# EAGLE board iot-gateway-main (EAGLE 9.6.1), part 1 of 2
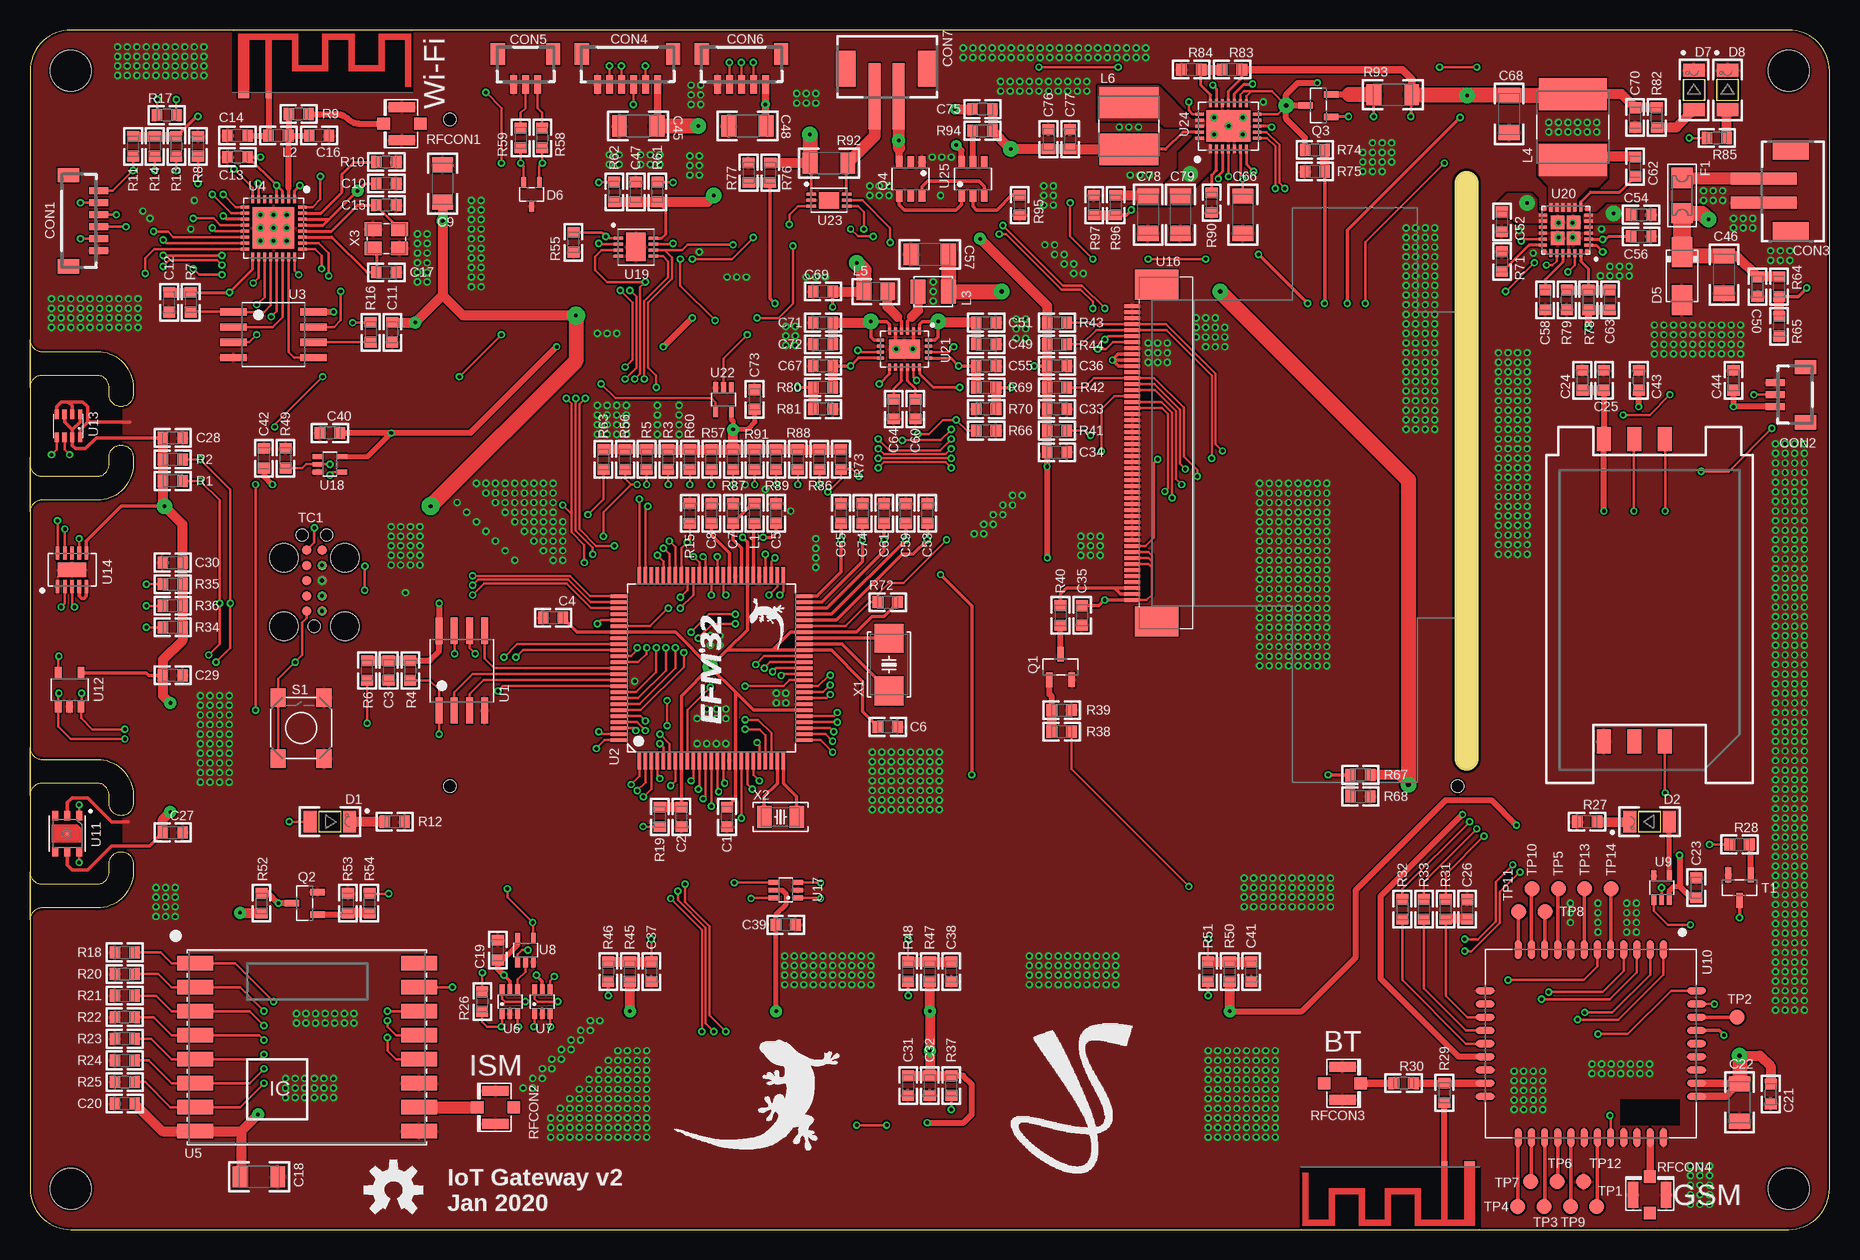
[diagram p11: board, top side]
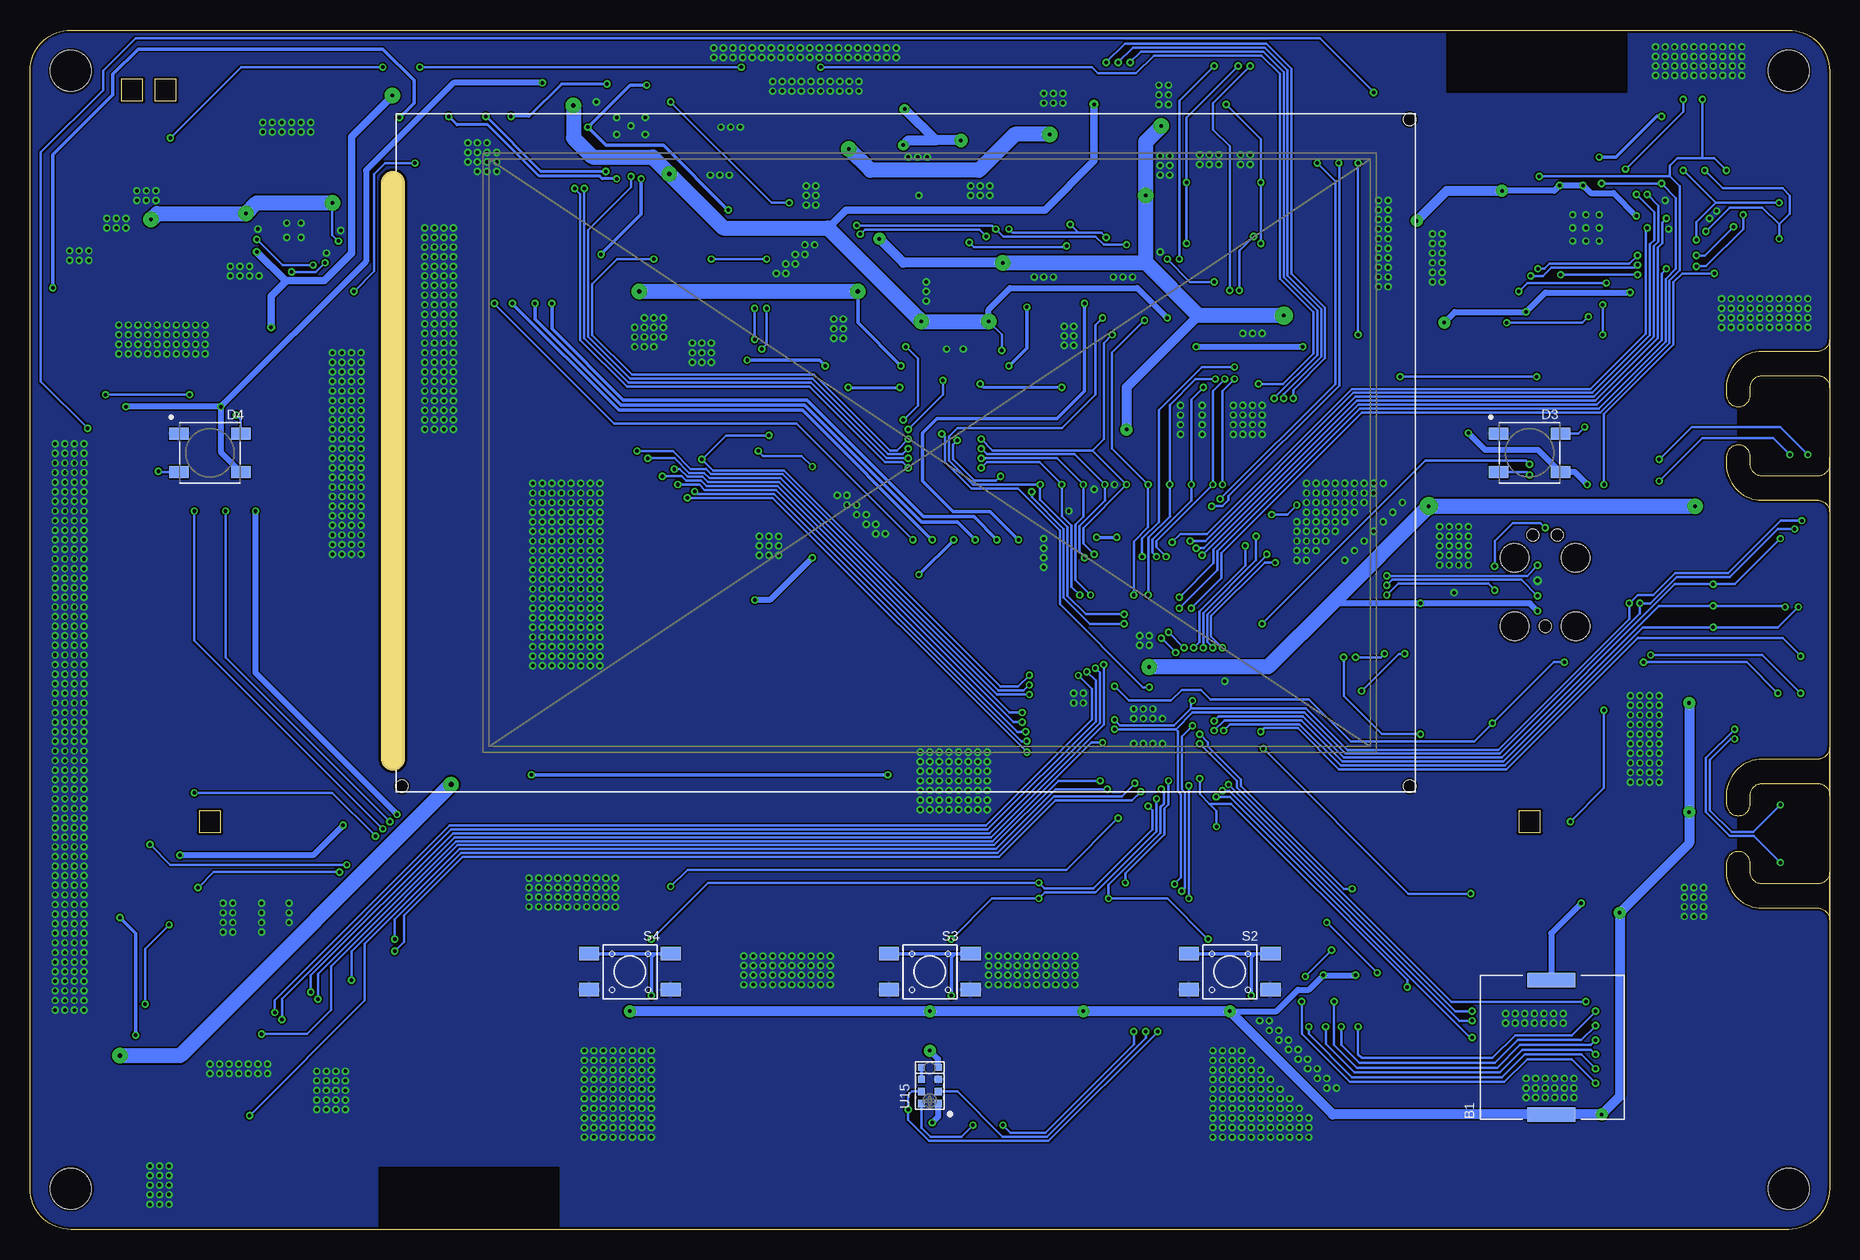
[diagram p12: board, bottom side, seen from below]

Size 150 x 100 mm. Coordinates in mm from the lower left corner, seen from the top.
Outline: 150,3.4 150,96.6 arc90 146.6,100 3.4,100 arc90 0,96.6 0,3.4 arc90 3.4,0 146.6,0 arc90 150,3.4
Copper layers (1*16): Top 0.035mm / dielectric 1.6mm / Bottom 0.035mm
Design rules "jlcpcb_2layer": minimum track width 5mil, minimum drill 0.3mm, track to track 5mil, track to pad 5mil, pad to pad 5mil, via to via 5mil, smd to smd 5mil, copper to edge 0.2mm, drill to drill 5mil, minimum pad ring 3mil, minimum via ring 3mil, stop-mask expansion 0.075mm, vias tented up to drill 10mm, thermal gap 5mil
Holes 3.4 mm at 146.6,96.6 146.6,3.4 3.4,3.4 3.4,96.6
tKeepout: area 0.9,94.1 to 5.9,99.1; area -1.6,-1.6 to 8.4,8.4; area 141.6,-1.6 to 151.6,8.4; area 0,3.4 to 3.4,8.4; area 3.4,0 to 8.4,3.4; area 146.6,3.4 to 150,8.4; area 141.6,0 to 146.6,3.4; area 144.1,94.1 to 149.1,99.1
bKeepout: area 144.1,94.1 to 149.1,99.1; area 0.9,94.1 to 5.9,99.1; area 0.9,0.9 to 5.9,5.9; area 144.1,0.9 to 149.1,5.9
Milling: area 0,68.6 to 8.6,74.2; area 0,59.8 to 8.6,65.4; area 0,34.5 to 8.6,40.2; area 0,25.8 to 8.6,31.5

## Footprints (pad centres in the part's own frame; a part is rotated, then mirrored left to right if it is on the bottom)
SMD = smd 1.2 x 4: 1 -5.6,0.1; 2 5.6,0.1
CAP0603 = smd 0.889 x 1.016: 1 -0.819,0; 2 0.819,0
CAP1206 = smd 1.27 x 1.778: 1 -1.549,0; 2 1.549,0
SH-06-TOP = smd 0.6 x 1.55: 1 2.5,-1.625; 2 1.5,-1.625; 3 0.5,-1.625; 4 -0.5,-1.625; 5 -1.5,-1.625; 6 -2.5,-1.625 | smd 1.2 x 1.8: FIT@1 3.8,0.9; FIT@2 -3.8,0.9
SH-03-TOP = smd 0.6 x 1.55: 1 1,-1.625; 2 0,-1.625; 3 -1,-1.625 | smd 1.2 x 1.8: FIT@1 2.3,0.9; FIT@2 -2.3,0.9
PH-02-TOP = smd 1 x 5.5: 1 -1,-2; 2 1,-2 | smd 1.6 x 3: P$1 -3.4,0.27; P$2 3.4,0.27
SH-05-TOP = smd 0.6 x 1.55: 1 2,-1.625; 2 1,-1.625; 3 0,-1.625; 4 -1,-1.625; 5 -2,-1.625 | smd 1.2 x 1.8: FIT@1 3.3,0.9; FIT@2 -3.3,0.9
1206_REV = smd 1.07 x 1.778: A 1.649,0; C -1.649,0
WS2812B-SMD5050 = smd 1.651 x 1: 1 2.577,-1.6; 2 2.577,1.6; 3 -2.577,1.6; 4 -2.577,-1.6
DO214AC = smd 2.5 x 1.7: A 2,0; C -2,0
SC70-3 = smd 0.4 x 0.9: 1 -0.65,-1; 2 0.65,-1; 3 0,1
TRACE_ANTENNA_2.4GHZ_15.2MM = smd 0.5 x 0.5: ANT 0,-0.25 | smd 0.9 x 0.5: GND -2.1,-0.25
1206 = smd 1.7 x 1.803: 1 -1.472,0; 2 1.472,0
IND0603 = smd 0.889 x 1.016: 1 -0.819,0; 2 0.819,0
IND3225 = smd 2 x 1.25: 1 0,-1.275; 2 0,1.275
IND0606 = smd 2.7 x 5.7: 1 -2.75,0; 2 2.75,0
IND0805 = smd 1.245 x 1.473: 1 -0.965,0; 2 0.965,0
IND0505 = smd 2.6 x 4.9: 1 -1.95,0; 2 1.95,0
SOT23 = smd 1.219 x 0.533: 1 -1.067,0.94; 2 -1.067,-0.94; 3 1.067,0
SOT23-6 = smd 1 x 0.55: 1 -1.4,0.95; 2 -1.4,0; 3 -1.4,-0.95; 4 1.4,-0.95; 5 1.4,0; 6 1.4,0.95
RES0603 = smd 0.889 x 1.016: 1 -0.819,0; 2 0.819,0
RES1206 = smd 1.27 x 1.778: 1 -1.549,0; 2 1.549,0
U.FL = smd 2.2 x 0.85: P$1 0,1.375; P$2 0,-1.375 | smd 1.05 x 1: P$3 1.525,0; P$4 -1.525,0
TAC_SW_SMD_RESET = smd 1.524 x 1.27: 1 -2.54,1.905; 2 2.54,1.905; 3 -2.54,-1.905; 4 2.54,-1.905
TAC_SW_SMD_4.5X4.5 = smd 1.7 x 1.1: 1 -3.4,1.5; 2 3.4,1.5; 3 -3.4,-1.5; 4 3.4,-1.5
SIMHOLDER-SMD = smd 2 x 1.2: C1 -12.61,-3.81; C2 -12.61,-1.27; C3 -12.61,1.27; C5 12.61,-3.81; C6 12.61,-1.27; C7 12.61,1.27
TC2050-IDC = smd 0.787 x 0.787: 1 -2.54,-0.635; 2 -1.27,-0.635; 3 0,-0.635; 4 1.27,-0.635; 5 2.54,-0.635; 6 2.54,0.635; 7 1.27,0.635; 8 0,0.635; 9 -1.27,0.635; 10 -2.54,0.635 | hole 0.991: -3.81,0; 3.81,1.016; 3.81,-1.016 | hole 2.375: -3.81,2.54; -3.81,-2.54; 1.905,2.54; 1.905,-2.54
PAD1.27MM = smd 1.27 x 1.27: TP 0,0
WSOIC8 = smd 0.6 x 2.2: 1 -1.905,-3.33; 2 -0.635,-3.33; 3 0.635,-3.33; 4 1.905,-3.33; 5 1.905,3.33; 6 0.635,3.33; 7 -0.635,3.33; 8 -1.905,3.33
QFP100 = smd 1.45 x 0.3: 1 -7.7,6; 2 -7.7,5.5; 3 -7.7,5; 4 -7.7,4.5; 5 -7.7,4; 6 -7.7,3.5; 7 -7.7,3; 8 -7.7,2.5; 9 -7.7,2; 10 -7.7,1.5; 11 -7.7,1; 12 -7.7,0.5; 13 -7.7,0; 14 -7.7,-0.5; 15 -7.7,-1; 16 -7.7,-1.5; 17 -7.7,-2; 18 -7.7,-2.5; 19 -7.7,-3; 20 -7.7,-3.5; 21 -7.7,-4; 22 -7.7,-4.5; 23 -7.7,-5; 24 -7.7,-5.5; 25 -7.7,-6; 51 7.7,-6; 52 7.7,-5.5; 53 7.7,-5; 54 7.7,-4.5; 55 7.7,-4; 56 7.7,-3.5; 57 7.7,-3; 58 7.7,-2.5; 59 7.7,-2; 60 7.7,-1.5; 61 7.7,-1; 62 7.7,-0.5; 63 7.7,0; 64 7.7,0.5; 65 7.7,1; 66 7.7,1.5; 67 7.7,2; 68 7.7,2.5; 69 7.7,3; 70 7.7,3.5; 71 7.7,4; 72 7.7,4.5; 73 7.7,5; 74 7.7,5.5; 75 7.7,6 | smd 0.3 x 1.45: 26 -6,-7.7; 27 -5.5,-7.7; 28 -5,-7.7; 29 -4.5,-7.7; 30 -4,-7.7; 31 -3.5,-7.7; 32 -3,-7.7; 33 -2.5,-7.7; 34 -2,-7.7; 35 -1.5,-7.7; 36 -1,-7.7; 37 -0.5,-7.7; 38 0,-7.7; 39 0.5,-7.7; 40 1,-7.7; 41 1.5,-7.7; 42 2,-7.7; 43 2.5,-7.7; 44 3,-7.7; 45 3.5,-7.7; 46 4,-7.7; 47 4.5,-7.7; 48 5,-7.7; 49 5.5,-7.7; 50 6,-7.7; 76 6,7.7; 77 5.5,7.7; 78 5,7.7; 79 4.5,7.7; 80 4,7.7; 81 3.5,7.7; 82 3,7.7; 83 2.5,7.7; 84 2,7.7; 85 1.5,7.7; 86 1,7.7; 87 0.5,7.7; 88 0,7.7; 89 -0.5,7.7; 90 -1,7.7; 91 -1.5,7.7; 92 -2,7.7; 93 -2.5,7.7; 94 -3,7.7; 95 -3.5,7.7; 96 -4,7.7; 97 -4.5,7.7; 98 -5,7.7; 99 -5.5,7.7; 100 -6,7.7
QFN32 = smd 0.7 x 0.25: 1 -2.4,1.75; 2 -2.4,1.25; 3 -2.4,0.75; 4 -2.4,0.25; 5 -2.4,-0.25; 6 -2.4,-0.75; 7 -2.4,-1.25; 8 -2.4,-1.75; 17 2.4,-1.75; 18 2.4,-1.25; 19 2.4,-0.75; 20 2.4,-0.25; 21 2.4,0.25; 22 2.4,0.75; 23 2.4,1.25; 24 2.4,1.75 | smd 0.25 x 0.7: 9 -1.75,-2.4; 10 -1.25,-2.4; 11 -0.75,-2.4; 12 -0.25,-2.4; 13 0.25,-2.4; 14 0.75,-2.4; 15 1.25,-2.4; 16 1.75,-2.4; 25 1.75,2.4; 26 1.25,2.4; 27 0.75,2.4; 28 0.25,2.4; 29 -0.25,2.4; 30 -0.75,2.4; 31 -1.25,2.4; 32 -1.75,2.4 | smd 3.45 x 3.45: 33 0,0
RFM69XW-XXXS2 = smd 3 x 1.2: 1 -9.35,7; 2 -9.35,5; 3 -9.35,3; 4 -9.35,1; 5 -9.35,-1; 6 -9.35,-3; 7 -9.35,-5; 8 -9.35,-7; 9 9.35,-7; 10 9.35,-5; 11 9.35,-3; 12 9.35,-1; 13 9.35,1; 14 9.35,3; 15 9.35,5; 16 9.35,7
SC70-6 = smd 0.4 x 0.9: 1 -0.65,-1; 2 0,-1; 3 0.65,-1; 4 0.65,1; 5 0,1; 6 -0.65,1
SC70-5 = smd 0.4 x 0.9: 1 -0.65,-1; 2 0,-1; 3 0.65,-1; 4 0.65,1; 5 -0.65,1
SIM800C = smd 1.6 x 0.6: 1 -7.85,6.05; 2 -7.85,4.95; 3 -7.85,3.85; 4 -7.85,2.75; 5 -7.85,1.65; 6 -7.85,0.55; 7 -7.85,-0.55; 8 -7.85,-1.65; 9 -7.85,-2.75; 10 -7.85,-3.85; 11 -7.85,-4.95; 12 -7.85,-6.05; 22 7.85,-6.05; 23 7.85,-4.95; 24 7.85,-3.85; 25 7.85,-2.75; 26 7.85,-1.65; 27 7.85,-0.55; 28 7.85,0.55; 29 7.85,1.65; 30 7.85,2.75; 31 7.85,3.85; 32 7.85,4.95; 33 7.85,6.05 | smd 0.6 x 1.6: 13 -4.4,-8.8; 14 -3.3,-8.8; 15 -2.2,-8.8; 16 -1.1,-8.8; 17 0,-8.8; 18 1.1,-8.8; 19 2.2,-8.8; 20 3.3,-8.8; 21 4.4,-8.8; 34 4.4,8.8; 35 3.3,8.8; 36 2.2,8.8; 37 1.1,8.8; 38 0,8.8; 39 -1.1,8.8; 40 -2.2,8.8; 41 -3.3,8.8; 42 -4.4,8.8
DFN6 = smd 0.8 x 0.5: 1 1.5,-1; 2 1.5,0; 3 1.5,1; 4 -1.5,1; 5 -1.5,0; 6 -1.5,-1 | smd 0.2 x 0.2: 7 0,0
SOT23-5 = smd 1 x 0.55: 1 -1.4,0.95; 2 -1.4,0; 3 -1.4,-0.95; 4 1.4,-0.95; 5 1.4,0.95
BMP280 = smd 0.35 x 0.8: 1 0.975,-0.95; 2 0.325,-0.95; 3 -0.325,-0.95; 4 -0.975,-0.95; 5 -0.975,0.95; 6 -0.325,0.95; 7 0.325,0.95; 8 0.975,0.95
LGA10 = smd 1.1 x 0.3: 1 -1.4,1.2; 2 -1.4,0.6; 3 -1.4,0; 4 -1.4,-0.6; 5 -1.4,-1.2; 6 1.4,-1.2; 7 1.4,-0.6; 8 1.4,0; 9 1.4,0.6; 10 1.4,1.2 | smd 1.2 x 2.4: 11 0,0
LGA8 = smd 0.6 x 0.6: 1 -0.7,1.506; 2 -0.7,0.496; 3 -0.7,-0.514; 4 -0.7,-1.524; 5 0.7,-1.524; 6 0.7,-0.514; 7 0.7,0.496; 8 0.7,1.506
FPC-50P-TFT-BOT = smd 1.3 x 0.3 bottom: 1 16.889,12.27; 2 16.889,11.77; 3 16.889,11.27; 4 16.889,10.77; 5 16.889,10.27; 6 16.889,9.77; 7 16.889,9.27; 8 16.889,8.77; 9 16.889,8.27; 10 16.889,7.77; 11 16.889,7.27; 12 16.889,6.77; 13 16.889,6.27; 14 16.889,5.77; 15 16.889,5.27; 16 16.889,4.77; 17 16.889,4.27; 18 16.889,3.77; 19 16.889,3.27; 20 16.889,2.77; 21 16.889,2.27; 22 16.889,1.77; 23 16.889,1.27; 24 16.889,0.77; 25 16.889,0.27; 26 16.889,-0.23; 27 16.889,-0.73; 28 16.889,-1.23; 29 16.889,-1.73; 30 16.889,-2.23; 31 16.889,-2.73; 32 16.889,-3.23; 33 16.889,-3.73; 34 16.889,-4.23; 35 16.889,-4.73; 36 16.889,-5.23; 37 16.889,-5.73; 38 16.889,-6.23; 39 16.889,-6.73; 40 16.889,-7.23; 41 16.889,-7.73; 42 16.889,-8.23; 43 16.889,-8.73; 44 16.889,-9.23; 45 16.889,-9.73; 46 16.889,-10.23; 47 16.889,-10.73; 48 16.889,-11.23; 49 16.889,-11.73; 50 16.889,-12.23 | smd 3.6 x 2.5 bottom: M1 18.914,-14.02; M2 18.914,14.06 | hole 1: -40.005,27.795; -40.005,-27.795; 44.005,27.795
DFN8 = smd 0.8 x 0.25: 1 -1.45,0.75; 2 -1.45,0.25; 3 -1.45,-0.25; 4 -1.45,-0.75; 5 1.45,-0.75; 6 1.45,-0.25; 7 1.45,0.25; 8 1.45,0.75 | smd 1.65 x 2.38: 9 0,0
QFN24_CORNER = smd 0.7 x 0.25: 1 -1.9,1.25; 2 -1.9,0.75; 3 -1.9,0.25; 4 -1.9,-0.25; 5 -1.9,-0.75; 6 -1.9,-1.25; 13 1.9,-1.25; 14 1.9,-0.75; 15 1.9,-0.25; 16 1.9,0.25; 17 1.9,0.75; 18 1.9,1.25 | smd 0.25 x 0.7: 7 -1.25,-1.9; 8 -0.75,-1.9; 9 -0.25,-1.9; 10 0.25,-1.9; 11 0.75,-1.9; 12 1.25,-1.9; 19 1.25,1.9; 20 0.75,1.9; 21 0.25,1.9; 22 -0.25,1.9; 23 -0.75,1.9; 24 -1.25,1.9 | smd 1.125 x 1.125: 25 -0.662,0.662; 26 0.662,0.662; 27 -0.662,-0.662; 28 0.662,-0.662 | smd 0.375 x 0.375: 29 -1.812,1.812; 30 1.812,1.812; 31 1.812,-1.812; 32 -1.812,-1.812
VQFN20 = smd 0.6 x 0.25: 1 -1.5,1.25; 2 -1.5,0.75; 3 -1.5,0.25; 4 -1.5,-0.25; 5 -1.5,-0.75; 6 -1.5,-1.25; 11 1.5,-1.25; 12 1.5,-0.75; 13 1.5,-0.25; 14 1.5,0.25; 15 1.5,0.75; 16 1.5,1.25 | smd 0.25 x 0.6: 7 -0.75,-2; 8 -0.25,-2; 9 0.25,-2; 10 0.75,-2; 17 0.75,2; 18 0.25,2; 19 -0.25,2; 20 -0.75,2 | smd 1.6 x 2.6: 21 0,0
DFN6' = smd 0.8 x 0.25: 1 -1.475,0.5; 2 -1.475,0; 3 -1.475,-0.5; 4 1.475,-0.5; 5 1.475,0; 6 1.475,0.5 | smd 1.65 x 1.35: 7 0,0
QFN24_ASYM = smd 0.7 x 0.25: 1 -1.9,1.5; 2 -1.9,1; 3 -1.9,0.5; 4 -1.9,0; 5 -1.9,-0.5; 6 -1.9,-1; 7 -1.9,-1.5; 13 1.9,-1.5; 14 1.9,-1; 15 1.9,-0.5; 16 1.9,0; 17 1.9,0.5; 18 1.9,1; 19 1.9,1.5 | smd 0.25 x 0.7: 8 -1,-2.4; 9 -0.5,-2.4; 10 0,-2.4; 11 0.5,-2.4; 12 1,-2.4; 20 1,2.4; 21 0.5,2.4; 22 0,2.4; 23 -0.5,2.4; 24 -1,2.4 | smd 2.65 x 3.65: 25 0,0
2-SMD-5032 = smd 2.4 x 2.4: 1 -2.2,0; 2 2.2,0
2-SMD-3215 = smd 1.2 x 1.8: 1 -1.35,0; 2 1.35,0
4-SMD-3225 = smd 1.4 x 1.15: 1 -1.1,0.8; 2 1.1,0.8; 3 1.1,-0.8; 4 -1.1,-0.8

## Placement (x,y rotation side)
B1  BUZZER-SMD  [SMD]  23.1,15.2 90 bottom
C1  100nF  [CAP0603]  58.1,34.4 270 top
C2  100nF  [CAP0603]  54.3,34.4 270 top
C3  100nF  [CAP0603]  29.9,46.6 270 top
C4  100nF  [CAP0603]  43.6,51 180 top
C5  100nF  [CAP0603]  62.2,59.7 90 top
C6  100nF  [CAP0603]  71.5,41.9 0 top
C7  4.7uF  [CAP0603]  58.6,59.7 90 top
C8  1uF  [CAP0603]  56.8,59.7 90 top
C9  100uF  [CAP1206]  34.4,87.2 90 top
C10  100nF  [CAP0603]  29.7,87.2 0 top
C11  100nF  [CAP0603]  30.2,74.8 270 top
C12  100nF  [CAP0603]  11.6,77.3 270 top
C13  100nF  [CAP0603]  17.3,89.4 180 top
C14  4pF  [CAP0603]  17.3,91.2 0 top
C15  20pF  [CAP0603]  29.7,85.4 0 top
C16  4.7pF  [CAP0603]  24.1,91.2 180 top
C17  20pF  [CAP0603]  29.7,79.8 0 top
C18  22uF  [CAP1206]  19.1,4.4 0 top
C19  100nF  [CAP0603]  39,23.3 90 top
C20  100nF  [CAP0603]  7.9,10.5 180 top
C21  100nF  [CAP0603]  145.1,11.3 270 top
C22  100uF  [CAP1206]  142.5,10.6 270 top
C23  100nF  [CAP0603]  138.9,28.5 90 top
C24  33pF  [CAP0603]  129.4,70.8 90 top
C25  1uF  [CAP0603]  131.2,70.8 90 top
C26  33pF  [CAP0603]  119.8,26.7 90 top
C27  100nF  [CAP0603]  11.9,33.1 0 top
C28  100nF  [CAP0603]  11.9,66 0 top
C29  100nF  [CAP0603]  11.9,46.2 0 top
C30  100nF  [CAP0603]  11.9,55.6 180 top
C31  1uF  [CAP0603]  73.2,12 270 top
C32  100nF  [CAP0603]  75,12 270 top
C33  10uF  [CAP0603]  85.6,68.4 0 top
C34  100nF  [CAP0603]  85.6,64.8 0 top
C35  100nF  [CAP0603]  87.7,51.2 270 top
C36  100nF  [CAP0603]  85.6,72 0 top
C37  1nF  [CAP0603]  51.8,21.5 270 top
C38  1nF  [CAP0603]  76.8,21.5 270 top
C39  100nF  [CAP0603]  63,25.4 0 top
C40  100nF  [CAP0603]  25,66.4 180 top
C41  1nF  [CAP0603]  101.8,21.5 270 top
C42  100nF  [CAP0603]  19.5,64.3 90 top
C43  100nF  [CAP0603]  134.1,70.8 90 top
C44  100nF  [CAP0603]  142,70.8 90 top
C45  22uF  [CAP1206]  50.7,92 180 top
C46  10uF  [CAP1206]  141.2,79.6 270 top
C47  100nF  [CAP0603]  50.5,86.5 90 top
C48  22uF  [CAP1206]  59.8,92 180 top
C49  100nF  [CAP0603]  79.7,73.8 0 top
C50  4.7uF  [CAP0603]  144,78.6 270 top
C51  4.7uF  [CAP0603]  79.7,75.6 0 top
C52  1uF  [CAP0603]  122.7,84 270 top
C53  470pF  [CAP0603]  74.8,59.7 90 top
C54  1uF  [CAP0603]  134.3,84.6 0 top
C55  100nF  [CAP0603]  79.7,72 0 top
C56  1uF  [CAP0603]  134.3,82.8 0 top
C57  100uF  [CAP1206]  75,81.3 180 top
C58  10nF  [CAP0603]  126.3,77.5 270 top
C59  470pF  [CAP0603]  73,59.7 90 top
C60  470pF  [CAP0603]  73.8,68.4 270 top
C61  470pF  [CAP0603]  71.2,59.7 90 top
C62  100nF  [CAP0603]  133.8,88.6 270 top
C63  10pF  [CAP0603]  131.7,77.5 90 top
C64  470pF  [CAP0603]  72,68.4 270 top
C65  470pF  [CAP0603]  67.6,59.7 90 top
C66  100uF  [CAP1206]  101.1,84.6 270 top
C67  10uF  [CAP0603]  66.1,72 180 top
C68  22uF  [CAP1206]  123.3,93 270 top
C69  100nF  [CAP0603]  66.1,78.2 180 top
C70  100nF  [CAP0603]  133.8,92.7 270 top
C71  100nF  [CAP0603]  66.1,75.6 180 top
C72  4.7uF  [CAP0603]  66.1,73.8 180 top
C73  100nF  [CAP0603]  60.4,69.2 90 top
C74  470pF  [CAP0603]  69.4,59.7 90 top
C75  100nF  [CAP0603]  79.4,93.4 180 top
C76  100nF  [CAP0603]  84.9,90.9 90 top
C77  10uF  [CAP0603]  86.7,90.9 90 top
C78  100uF  [CAP1206]  93.2,84.6 270 top
C79  22uF  [CAP1206]  95.9,84.6 270 top
CON1  6P-SH-TOP  [SH-06-TOP]  4.1,84.1 90 top
CON2  3P-SH-TOP  [SH-03-TOP]  147.1,69.6 270 top
CON3  2P-PH-TOP  [PH-02-TOP]  146.5,86.6 270 top
CON4  6P-SH-TOP  [SH-06-TOP]  49.8,97.1 0 top
CON5  3P-SH-TOP  [SH-03-TOP]  41.3,97.1 0 top
CON6  5P-SH-TOP  [SH-05-TOP]  59.3,97.1 0 top
CON7  2P-PH-TOP  [PH-02-TOP]  71.4,96.5 0 top
D1  BLUE  [1206_REV]  25,34 180 top
D2  WHITE  [1206_REV]  135,34 0 top
D3  WS2812B  [WS2812B-SMD5050]  25,64.75 0 bottom
D4  WS2812B  [WS2812B-SMD5050]  135,64.75 0 bottom
D5  SMAJ24A  [DO214AC]  137.7,79.5 270 top
D6  SP0502BAJT  [SC70-3]  41.8,86.3 180 top
D7  LED1206-REV  [1206_REV]  138.7,95 270 top
D8  RED  [1206_REV]  141.5,95 270 top
E1  2.4GHZTRACE-15.2MM  [TRACE_ANTENNA_2.4GHZ_15.2MM]  19.9,94.8 0 top
E2  2.4GHZTRACE-15.2MM  [TRACE_ANTENNA_2.4GHZ_15.2MM]  117.9,5.2 180 top
F1  2.6A Hold  [1206]  137.7,86.2 90 top
L1  4.7uH  [IND0603]  60.4,59.7 270 top
L2  1.8nH  [IND0603]  20.7,91.2 0 top
L3  470nH  [IND3225]  75.3,78.2 90 top
L4  4.7uH  [IND0606]  128.6,91.9 90 top
L5  1uH  [IND0805]  70.5,78.2 180 top
L6  2.2uH  [IND0505]  91.6,92 270 top
LOGO1  OSHW-LOGOM  [OSHW-LOGO-M]  30.3,3.3 0 top
LOGO2  JS-10MM  [JS_10MM]  92.8,17.7 0 top
LOGO3  GECKO-14MM  [GECKO_14MM]  63.6,11.2 0 top
Q1  AO3400  [SOT23]  85.9,46.9 90 top
Q2  AO3400  [SOT23]  22.9,27.2 180 top
Q3  AO3400  [SOT23]  107.4,93.7 180 top
Q4  FS8205  [SOT23-6]  73.4,87.6 270 top
R1  2.2K Ohms  [RES0603]  11.9,62.4 180 top
R2  2.2K Ohms  [RES0603]  11.9,64.2 180 top
R3  2.2K Ohms  [RES0603]  53.2,64.2 90 top
R4  100K Ohms  [RES0603]  31.7,46.6 90 top
R5  2.2K Ohms  [RES0603]  51.4,64.2 90 top
R6  100K Ohms  [RES0603]  28.1,46.6 90 top
R7  100K Ohms  [RES0603]  13.4,77.3 90 top
R8  10K Ohms  [RES0603]  14,90.3 270 top
R9  0 Ohms  [RES0603]  22.4,93 180 top
R10  12K Ohms  [RES0603]  29.7,89 180 top
R11  10K Ohms  [RES0603]  8.6,90.3 90 top
R12  330 Ohms  [RES0603]  30.4,34 180 top
R13  10K Ohms  [RES0603]  12.2,90.3 90 top
R14  10K Ohms  [RES0603]  10.4,90.3 90 top
R15  10K Ohms  [RES0603]  55,59.7 270 top
R16  200 Ohms  [RES0603]  28.4,74.8 90 top
R17  0 Ohms  [RES0603]  11.4,92.9 180 top
R18  10K Ohms  [RES0603]  7.9,23.1 0 top
R19  100K Ohms  [RES0603]  52.5,34.4 90 top
R20  100K Ohms  [RES0603]  7.9,21.3 0 top
R21  100K Ohms  [RES0603]  7.9,19.5 0 top
R22  100K Ohms  [RES0603]  7.9,17.7 0 top
R23  100K Ohms  [RES0603]  7.9,15.9 0 top
R24  100K Ohms  [RES0603]  7.9,14.1 0 top
R25  100K Ohms  [RES0603]  7.9,12.3 0 top
R26  0 Ohms  [RES0603]  37.7,19 270 top
R27  330 Ohms  [RES0603]  129.8,34 0 top
R28  10K Ohms  [RES0603]  142.5,32.1 180 top
R29  0 Ohms  [RES0603]  117.9,11.4 270 top
R30  0 Ohms  [RES0603]  114.5,12.2 0 top
R31  22 Ohms  [RES0603]  118,26.7 90 top
R32  22 Ohms  [RES0603]  114.4,26.7 270 top
R33  22 Ohms  [RES0603]  116.2,26.7 270 top
R34  10K Ohms  [RES0603]  11.9,50.2 0 top
R35  10K Ohms  [RES0603]  11.9,53.8 0 top
R36  100K Ohms  [RES0603]  11.9,52 0 top
R37  100K Ohms  [RES0603]  76.8,12 90 top
R38  22 Ohms  [RES0603]  86,41.5 180 top
R39  10K Ohms  [RES0603]  86,43.3 180 top
R40  0 Ohms  [RES0603]  85.9,51.2 90 top
R41  100K Ohms  [RES0603]  85.6,66.6 180 top
R42  100K Ohms  [RES0603]  85.6,70.2 180 top
R43  100K Ohms  [RES0603]  85.6,75.6 180 top
R44  100K Ohms  [RES0603]  85.6,73.8 180 top
R45  1 MOhms  [RES0603]  50,21.5 270 top
R46  100 Ohms  [RES0603]  48.2,21.5 90 top
R47  1 MOhms  [RES0603]  75,21.5 270 top
R48  100 Ohms  [RES0603]  73.2,21.5 90 top
R49  100K Ohms  [RES0603]  21.3,64.3 270 top
R50  1 MOhms  [RES0603]  100,21.5 270 top
R51  100 Ohms  [RES0603]  98.2,21.5 90 top
R52  1K Ohms  [RES0603]  19.3,27.2 270 top
R53  10K Ohms  [RES0603]  26.5,27.2 270 top
R54  22 Ohms  [RES0603]  28.3,27.2 270 top
R55  100K Ohms  [RES0603]  45.3,82.3 90 top
R56  100K Ohms  [RES0603]  49.6,64.2 90 top
R57  100K Ohms  [RES0603]  56.8,64.2 90 top
R58  33 Ohms  [RES0603]  42.7,91 90 top
R59  33 Ohms  [RES0603]  40.9,91 90 top
R60  100K Ohms  [RES0603]  55,64.2 90 top
R61  4.7K Ohms  [RES0603]  52.3,86.5 270 top
R62  4.7K Ohms  [RES0603]  48.7,86.5 270 top
R63  10K Ohms  [RES0603]  47.8,64.2 90 top
R64  147K Ohms  [RES0603]  145.8,78.6 90 top
R65  21K Ohms  [RES0603]  145.8,75.3 90 top
R66  100K Ohms  [RES0603]  79.7,66.6 180 top
R67  100K Ohms  [RES0603]  110.9,37.9 0 top
R68  100K Ohms  [RES0603]  110.9,36.1 180 top
R69  357K Ohms  [RES0603]  79.7,70.2 180 top
R70  61.9K Ohms  [RES0603]  79.7,68.4 0 top
R71  41.2K Ohms  [RES0603]  122.7,80.7 270 top
R72  100K Ohms  [RES0603]  71.5,52.3 0 top
R73  100K Ohms  [RES0603]  67.6,64.2 90 top
R74  100K Ohms  [RES0603]  107.1,90 180 top
R75  100K Ohms  [RES0603]  107.1,88.2 0 top
R76  100K Ohms  [RES0603]  61.7,88.1 90 top
R77  100K Ohms  [RES0603]  59.9,88.1 270 top
R78  1M Ohms  [RES0603]  129.9,77.5 270 top
R79  232K Ohms  [RES0603]  128.1,77.5 90 top
R80  309K Ohms  [RES0603]  66.1,70.2 0 top
R81  71.5K Ohms  [RES0603]  66.1,68.4 180 top
R82  510 Ohms  [RES0603]  135.6,92.7 90 top
R83  178K Ohms  [RES0603]  100.2,96.7 0 top
R84  57.6K Ohms  [RES0603]  96.8,96.7 0 top
R85  330 Ohms  [RES0603]  140.6,91 180 top
R86  100K Ohms  [RES0603]  65.8,64.2 90 top
R87  100K Ohms  [RES0603]  58.6,64.2 90 top
R88  100K Ohms  [RES0603]  64,64.2 90 top
R89  100K Ohms  [RES0603]  62.2,64.2 90 top
R90  2K Ohms  [RES0603]  98.5,85.6 90 top
R91  100K Ohms  [RES0603]  60.4,64.2 90 top
R92  25m Ohms  [RES1206]  66.6,88.9 180 top
R93  10m Ohms  [RES1206]  113.6,94.6 0 top
R94  100 Ohms  [RES0603]  79.4,91.6 0 top
R95  2K Ohms  [RES0603]  82.5,85.4 90 top
R96  1.5M Ohms  [RES0603]  90.5,85.4 90 top
R97  274K Ohms  [RES0603]  88.7,85.4 270 top
RFCON1  RFCON-U.FL  [U.FL]  31,92.2 180 top
RFCON2  RFCON-U.FL  [U.FL]  38.8,10.2 180 top
RFCON3  RFCON-U.FL  [U.FL]  109.4,12.2 0 top
RFCON4  RFCON-U.FL  [U.FL]  135,2.9 90 top
S1  [TAC_SW_SMD_RESET]  22.6,41.8 90 top
S2  [TAC_SW_SMD_4.5X4.5]  50,21.5 0 bottom
S3  [TAC_SW_SMD_4.5X4.5]  75,21.5 0 bottom
S4  [TAC_SW_SMD_4.5X4.5]  100,21.5 0 bottom
SIM1  SIMHOLDER-SMD  [SIMHOLDER-SMD]  135,53.3 270 top
T1  BC817  [SOT23]  142.5,28.5 270 top
TC1  TC2050-IDC  [TC2050-IDC]  23.7,54.1 90 top
TP1  TESTPOINT-1.27MM  [PAD1.27MM]  130.6,1.9 0 top
TP2  TESTPOINT-1.27MM  [PAD1.27MM]  142.3,17.7 0 top
TP3  TESTPOINT-1.27MM  [PAD1.27MM]  126.2,1.9 0 top
TP4  TESTPOINT-1.27MM  [PAD1.27MM]  124,1.9 0 top
TP5  TESTPOINT-1.27MM  [PAD1.27MM]  127.4,28.4 0 top
TP6  TESTPOINT-1.27MM  [PAD1.27MM]  127.3,4 0 top
TP7  TESTPOINT-1.27MM  [PAD1.27MM]  125.1,4 0 top
TP8  TESTPOINT-1.27MM  [PAD1.27MM]  126.3,26.5 0 top
TP9  TESTPOINT-1.27MM  [PAD1.27MM]  128.4,1.9 0 top
TP10  TESTPOINT-1.27MM  [PAD1.27MM]  125.2,28.4 0 top
TP11  TESTPOINT-1.27MM  [PAD1.27MM]  124.1,26.5 0 top
TP12  TESTPOINT-1.27MM  [PAD1.27MM]  129.5,4 0 top
TP13  TESTPOINT-1.27MM  [PAD1.27MM]  129.6,28.4 0 top
TP14  TESTPOINT-1.27MM  [PAD1.27MM]  131.8,28.4 0 top
U1  SST26VF064B  [WSOIC8]  36,46.6 0 top
U2  EFM32GG11B820F2048GQ100  [QFP100]  56.8,46.8 90 top
U3  SST26VF016B  [WSOIC8]  20.3,74.6 270 top
U4  ESP8266EX  [QFN32]  20.3,83.5 270 top
U5  RFM69HW  [RFM69XW-XXXS2]  23.1,15.2 0 top
U6  74LVC1G332  [SC70-6]  40,19 0 top
U7  74LVC1G332  [SC70-6]  42.7,19 0 top
U8  74LVC1G32  [SC70-5]  41.3,23.3 0 top
U9  74LVC1G08  [SC70-5]  136,28.5 0 top
U10  SIM800C  [SIM800C]  130.1,15.5 270 top
U11  SI7021  [DFN6]  3.1,33 90 top
U12  SI7210  [SOT23-5]  3.3,45 90 top
U13  BMP280  [BMP280]  3.2,67 0 top
U14  CCS811  [LGA10]  3.5,55 90 top
U15  TMG39933  [LGA8]  75,12 180 bottom
U16  ER-TFT035-6-BOT  [FPC-50P-TFT-BOT]  75,64.75 180 bottom
U17  74LVC1G11  [SC70-6]  63,28.3 90 top
U18  74LVC1G17  [SC70-5]  25,63.8 270 top
U19  LTC4313-1  [DFN8]  50.5,81.9 0 top
U20  LT8640S  [QFN24_CORNER]  128,83.3 180 top
U21  MIC23159  [VQFN20]  72.9,73.4 270 top
U22  74LVC1G04  [SC70-5]  57.8,69.2 180 top
U23  LTC2942  [DFN6']  66.6,85.8 0 top
U24  LTC4040  [QFN24_ASYM]  99.9,92 90 top
U25  FS312F-G  [SOT23-6]  78.6,87.6 90 top
X1  24 MHz  [2-SMD-5032]  71.6,47.1 90 top
X2  32.768 kHz  [2-SMD-3215]  62.55,34.4 0 top
X3  26 MHz  [4-SMD-3225]  29.7,82.6 0 top

## Tracks (layer width: path | path; a pad name or v marks a point on that pad's centre or on a via)
1V8
  Top 0.305: U2.58 59.3,56.8 58.6,57.5 C7.1 60.24,60.52 L1.1
3V3  (via drill 0.3, 0.3 pad 1, 0.3 pad 1.3, 0.3 pad 1.5)
  Top 0.2: U16.7 93.22,55.48 93.5,55.2 | 93.5,55.2 93.5,52.9 93.08,52.48 U16.1 | U16.9 93.22,56.48 93.5,56.2 93.5,55.7 | 93.5,55.7 93.5,55.2 | U16.8 93.22,55.98 93.5,55.7 | U16.35 90.38,69.48 89.3,68.4 v89.3,64.9
  Top 0.254: U19.8 52.65,82.65 53,83 53,84.98 R61.2 | U21.10 69.05,72.65 v68.4,72 | U4.30 24.95,84.25 | C10.1 27.9,87.2 v27.3,86.6 24.95,84.25 | U4.29 24.45,83.75 24.95,84.25 | U4.4 v20.55,87.05 | v20.55,87.05 18.2,89.4 C13.1 | U4.3 21.05,86.55 v20.55,87.05 | R7.2 v16.62,78.12 18.55,80.05 U4.17 | U4.1 22.05,86.6 v22.5,87.05 | U4.11 16.35,84.25 v16.1,84.5
  Top 0.305: v68.4,72 C67.1 | v66.9,76.9 66.9,78.18 C69.1 | C4.1 44.42,50.98 45.6,49.8 U2.82 53.8,49.8 v56.7,46.9 | C6.1 69.4,43.18 69.4,45.7 66.8,48.3 U2.41 61.9,48.3 | C2.1 U2.8 54.3,44.5 v56.7,46.9 | C1.1 58.8,35.92 U2.17 58.8,44.8 | U13.6 2.88,67.33 3.52,66.67 | 3.52,66.67 U13.2 3.52,65.38 3.8,65.1 4.6,65.1 5.5,66 C28.1 | U13.8 4.17,67.33 3.52,66.67 | U11.5 3.1,30.4 3.5,30 4.8,30 6.8,32 9.98,32 C27.1 | v59.4,57.7 59.8,57.3 U2.57 59.8,50 58.1,48.3 | C5.1 62.2,58.08 61.82,57.7 v61.1,57.7 | 58.8,44.8 v56.7,46.9 | U2.31 60.3,43.3 58.8,44.8 | 61.9,48.3 58.1,48.3 | 58.1,48.3 v56.7,46.9 | 61.9,48.3 63.4,49.8 U2.44 68.9,49.8 70.2,51.1 71.2,51.1 72.32,52.22 R72.2 | U16.1 v89.58,52.48 89.12,52.02 C35.1 | U14.6 4.7,57.4 7.6,60.3 v11.2,60.3 | U12.4 9.7,46.4 9.9,46.2 C29.1 | U16.42 90.68,72.98 90.2,72.5 v90.22,72.48 | U16.40 90.72,71.98 v90.22,72.48 | U16.41 v90.22,72.48 | v83.7,72 C36.1 | C13.1 v19.2,89.4 | R13.2 13.88,92.8 v14,92.8 | U6.5 40,20.7 v39.5,21.2 | U7.5 42.7,20.7 v42.2,21.2
  Top 0.406: U22.5 58.45,67.55 58.6,67.4 v58.6,66.7 59.8,66.7 60.4,67.3 C73.1 | U9.3 136.65,28.25 137,28.6 137.5,28.6 | v62.2,18.2 62.2,25.38 | 62.2,25.38 62.2,26.28 63,27.08 63,28 62.7,28.3 U17.5 | 62.2,25.38 C39.1 | U8.5 40.65,23.75 39.38,22.48 C19.1
  Top 0.508: v25.3,76.5 U3.8 | v34.1,52.2 U1.8 | U1.8 | R4.2 33.32,47.42 34.1,48.2 U1.8 | v74.8,8.9 77.8,8.9 78.5,9.6 78.5,12.1 77.78,12.82 R37.2 | v100,18.2 106,18.2 110.5,22.7 110.5,28.3 118,35.8 121.8,35.8 v123.9,33.7 | v137.5,31.2 137.5,28.6 138.42,27.68 C23.1 | C34.1 v84.78,63.6 84.78,56.02 v84.8,56 | v39.5,21.2 39,21.7 C19.1
  Top 0.61: CON4.1 52.3,92.05 C45.1
  Top 0.813: R62.2 C47.1 R61.2 56.48,85.68 v57,86.2 | C69.1 L5.2 | R80.2 C67.1 | C12.1 R7.2 | C9.1 v34.4,84.1 34.4,77.9 | C11.1 v32.12,75.62 34.4,77.9 | v45.5,76.2 36.1,76.2 34.4,77.9 | v79.2,82.6 84.78,77.02 R43.2 R44.2 C36.1 R42.2 C33.1 R41.2 C34.1 | R87.2 v58.6,66.7 | R87.2 R57.2 R60.2 R3.2 R5.2 R56.2 R63.2 | R87.2 R91.2 R89.2 R88.2 R86.2 R73.2 | C28.1 R2.2 R1.2 11.08,60.42 v11.2,60.3 12.72,58.78 C30.1 R35.2 R36.2 R34.2 12.72,49.12 11.08,47.48 C29.1 11.08,44.52 v11.7,43.9 | v19,9.6 17.6,8.2 | 17.6,8.2 U5.8 11,8.2 8.72,10.48 C20.1 | v17.5,26.4 19.28,26.4 R52.2 | C27.1 11.08,34.18 v11.7,34.8 | R4.2 C3.1 R6.2 | R11.2 R14.2 R13.2 | v50,18.2 R45.2 | R47.2 v75,18.2 v75,14.9 C32.1 | C31.1 C32.1 | C32.1 R37.2 | v100,18.2 R50.2 | R19.2 C2.1 | C18.1 17.6,4.45 17.6,8.2
  Top 1.27: L5.2 69.53,79.97 v68.9,80.6 | v45.5,76.2 45.5,72.4 v33.4,60.3 | v55.7,92 C45.1
  Bottom 0.2: v89.3,64.9 88.9,64.5 85.68,64.5 v84.78,63.6
  Bottom 0.305: v68.4,72 66.9,73.5 v66.9,76.9 | v59.4,57.7 v61.1,57.7 | v90.22,72.48 84.18,72.48 v83.7,72 | v19.2,89.4 17.8,89.4 14.4,92.8 v14,92.8
  Bottom 0.508: v32.12,75.62 31.24,76.5 v25.3,76.5 23.68,78.12 v16.62,78.12 | v27.3,86.6 22.95,86.6 v22.5,87.05 v20.55,87.05 19.9,86.4 18,86.4 v16.1,84.5 | TC1.1 24.98,52.2 v34.1,52.2 41.4,52.2 41.45,52.25 | U15.4 74.3,14.2 v75,14.9 | U15.1 74.3,9.4 v74.8,8.9 | v123.9,33.7 126.4,31.2 v137.5,31.2 | v84.8,56 88.32,52.48 v89.58,52.48 | v50,18.2 46.1,18.2 44.3,20 43.4,20 v42.2,21.2 v39.5,21.2
  Bottom 0.813: v34.4,84.1 31.9,86.6 v27.3,86.6 | v68.9,80.6 77.2,80.6 v79.2,82.6 | 52.6,76.2 58.6,70.2 v58.6,66.7 | v11.7,43.9 v11.7,34.8 11.7,32.2 v17.5,26.4 17.5,11.1 v19,9.6 B1.1 41.4,9.6 v50,18.2 v62.2,18.2 v75,18.2 v100,18.2
  Bottom 1.27: v68.9,80.6 57,80.6 | v45.5,76.2 52.6,76.2 57,80.6 | v11.2,60.3 v33.4,60.3 41.45,52.25 46.8,46.9 v56.7,46.9 | 57,80.6 v57,86.2 57,90.7 v55.7,92
  other vias: 24.34,51.56
3V3_FB  (via drill 0.3)
  Top 0.254: R80.1 v64,70.2 | v70.8,70.5 71.65,71.35 U21.11
  Top 0.813: R80.1 R81.2
  Bottom 0.254: v64,70.2 70.5,70.2 v70.8,70.5
3V3_SS
  Top 0.254: C64.1 72,70.1 72.65,70.75 U21.13
3V3_SW
  Top 0.305: U21.4 72.65,75.75 72.3,76.1
  Top 0.813: 72.3,76.1 71.47,76.94 L5.1
4V2  (via drill 0.3, 0.4 pad 1.3)
  Top 0.254: U21.17 76.75,72.65 v77.4,72
  Top 0.305: v77.4,72 C55.1
  Top 0.61: U10.35 142.45,12.2 | 142.45,12.2 C22.1 | U10.34 141.35,11.1 142.45,12.2
  Top 0.813: v142.5,14.5 144.2,14.5 145.1,13.6 C21.1 | R69.2 C55.1 | v114.9,37.1 114.1,37.9 R67.2
  Top 1.27: C57.1 76.58,81.27 L3.1 v81,78.2 | v99.2,78.2 114.9,62.5 v114.9,37.1 | v142.5,14.5 C22.1
  Bottom 0.305: v77.4,72 81,75.6 v81,78.2
  Bottom 1.27: v81,78.2 v99.2,78.2 | v114.9,37.1 137.5,14.5 v142.5,14.5
4V2_EN  (via drill 0.3)
  Top 0.2: U2.9 54.8,43.3 v56.7,45.2 | v74,66.33 74.93,66.33 76.1,67.5 v77.2,67.5 78.1,66.6 R66.2 | v77,73.6 76.55,73.15 U21.18
  Bottom 0.2: v56.7,45.2 57.23,45.2 64.16,52.14 64.16,58.27 67.66,61.77 71.53,61.77 73.73,63.97 73.73,66.05 v74,66.33 | v77.2,67.5 76,68.7 76,72.6 v77,73.6
4V2_FB  (via drill 0.3)
  Top 0.254: R69.1 v81.8,70.2 | v77.5,70.2 75.3,70.2 74.15,71.35 U21.16
  Top 0.813: R69.1 R70.2
  Bottom 0.254: v81.8,70.2 v77.5,70.2
4V2_PGOOD  (via drill 0.3)
  Top 0.2: U2.95 50.9,43.3 54.5,46.9 v54.5,48.1 | v55.7,49.3 56.9,50.5 v58.8,50.5 | v66.5,61.5 66.52,61.5 67.6,62.58 R73.1 68.52,63.38 v69.1,62.8 | v72.7,65.8 75.9,65.8 v76.8,66.7 | v73.9,70.8 73.65,71.05 U21.15
  Bottom 0.2: v54.5,48.1 v55.7,49.3 | v58.8,50.5 61.66,50.5 63.84,52.67 63.84,58.41 66.5,61.08 v66.5,61.5 | v76.8,66.7 73.9,69.6 v73.9,70.8 | v69.1,62.8 69.47,62.43 71.27,62.43 73.07,64.23 73.07,65.43 v72.7,65.8
4V2_SS
  Top 0.254: C60.1 73.8,70.1 73.15,70.75 U21.14
4V2_SW
  Top 0.305: U21.3 73.15,75.75 73.5,76.1
  Top 0.813: 73.5,76.1 74.03,76.62 L3.2
4V2_VSENSE  (via drill 0.3)
  Top 0.305: U2.47 66.83,51.3 73,57.47 v73,57.5 C59.1 | R67.1 v108.2,37.9 | v78.5,37.9 78.5,52 v75.9,54.6
  Top 0.813: R68.2 R67.1
  Bottom 0.305: v108.2,37.9 v78.5,37.9 | v73,57.5 v75.9,54.6
5V0  (via drill 0.3, 0.3 pad 0.75, 0.3 pad 1.3, 0.4 pad 1.3)
  Top 0.2: U24.12 104,93 v104.7,93.7 103.5,94.9 101.8,94.9 | U24.13 101.4,94.5 101.8,94.9 | U24.14 100.9,94.6 101.2,94.9 101.8,94.9 | U21.9 69.15,73.15 v69,73.3
  Top 0.305: U21.6 71.65,75.45 71.4,75.7 v70.1,75.7 70.1,74.4 70.35,74.15 U21.7 | U21.20 75.45,74.15 75.7,74.4 v75.7,75.7 74.4,75.7 74.15,75.45 U21.1
  Top 0.406: U18.5 28.15,64.45 v30.1,66.4
  Top 0.508: Q3.3 v104.7,93.7 | R74.2 106.28,91.02 104.7,92.6 v104.7,93.7 | v104.7,93.7 104.7,94.6 105.7,95.6 v107.3,95.6 | v134.1,68.6 C43.1 | C44.1 v142,68.6 CON2.1 | v55.2,76 v52.8,73.6 | v43.9,73.6 36.7,66.4 v30.1,66.4 C40.1 | C42.1 19.5,62.8 v20.2,62.1
  Top 0.61: CON6.1 v61.3,93.8 61.3,92.05 C48.1
  Top 0.813: R96.2 93.13,86.22 C78.1 | v75.7,75.7 75.8,75.6 C51.1 C49.1 | v70.1,75.7 70,75.6 C71.1 C72.1
  Bottom 0.2: v69,73.3 69,74.6 v70.1,75.7
  Bottom 0.508: v107.3,95.6 114.7,95.6 122,88.3 122,80.7 v134.1,68.6 | v134.1,68.6 134.1,64.83 D4.1 | v134.1,68.6 v142,68.6 | v70.1,75.7 70.1,76.7 68.3,78.5 57.7,78.5 v55.2,76 | v52.8,73.6 v43.9,73.6 | v30.1,66.4 28.7,65 24.27,65 D3.1 21.25,63.15 v20.2,62.1
  Bottom 0.61: 83.5,83.5 82,85 65.4,85 61.3,89.1 v61.3,93.8
  Bottom 1.27: v104.7,93.7 104.7,91 103.1,89.4 98.1,89.4 v96.7,88 92.2,83.5 83.5,83.5 v75.7,75.7 v70.1,75.7
  pour Top (no thermals): 97.8,91 97.1,91 95.8,89.7 95.8,88.3 94.5,87 92.2,87 92.2,85.5 96.8,85.5 96.8,86.8 98.4,88.4 98.4,90.4 97.8,90.4
5V0_BACKUP  (via drill 0.3)
  Top 0.2: R85.2 v138.3,91 | v120.6,96.9 v117.5,96.9 | v90.7,96.9 v84.1,96.9 | v47.6,70.5 48.8,69.3 56.8,69.3 57.15,68.95 U22.4
  Bottom 0.2: v138.3,91 132.4,96.9 v120.6,96.9 | v117.5,96.9 v90.7,96.9 | v84.1,96.9 61.5,96.9 61,96.4 57.8,96.4 56.33,97.87 47.34,97.87 45.83,96.36 45.83,79.27 43.03,76.47 43.03,73.03 45.56,70.5 v47.6,70.5
5V0_FB  (via drill 0.3)
  Top 0.254: v103.5,91.9 103.4,92 U24.10 | v98.6,95.4 98.9,95.1 U24.18
  Top 0.305: R96.1 91.38,84.58 v91.8,85
  Top 0.813: R97.2 R96.1
  Bottom 0.305: v91.8,85 97.2,90.4 102,90.4 v103.5,91.9 100,95.4 v98.6,95.4
5V0_GATE  (via drill 0.3)
  Top 0.254: U24.15 100.4,94.7 101.2,95.5 v101.9,95.5 | v109.9,92.8 109.86,92.76 Q3.1
  Bottom 0.254: v101.9,95.5 105.7,95.5 108.4,92.8 v109.9,92.8
5V0_NBU  (via drill 0.3)
  Top 0.254: U24.7 101.4,88.8 v102,88.2 | v112,92.8 112.01,92.81 112.01,94.64
  Top 0.508: Q3.2 109.96,94.64
  Top 1.27: 109.96,94.64 112.01,94.64 R93.1
  Bottom 0.254: v102,88.2 107.4,88.2 v112,92.8
5V0_NBU_ISENSE  (via drill 0.3)
  Top 0.254: U24.3 99.4,88.2 99.05,87.85 v99.05,87.6
  Top 0.305: v102.4,81.3 v106.5,77.2 | C74.1 v69.4,57.5 69.4,55.7 66,52.3 U2.49
  Bottom 0.305: v99.05,87.6 99.05,84.65 v102.4,81.3 | v106.5,77.2 106.5,75.12 100.54,69.16 85.24,69.16 75.51,59.43 71.33,59.43 v69.4,57.5
5V0_NBU_NSENS  (via drill 0.3, 0.3 pad 0.65, 0.3 pad 1.3)
  Top 0.254: U24.6 100.9,87.8 v101.1,87.6 C66.1 | v115.1,92.8 115.15,92.85 R93.2 | U24.16 99.9,94.9 101.02,96.02 R83.2 | U20.1 130.55,82.05 v131.1,81.5
  Top 0.61: v129.9,75.2 R78.2 | R83.2 114.4,96.7 115.2,95.9 115.2,94.65 R93.2
  Top 0.813: L4.2 132.67,94.65 C70.1 R82.2 | R78.2 C63.1
  Top 1.27: L4.2 128.5,94.55 C68.1 v119.8,94.55 115.2,94.55 R93.2
  Bottom 0.254: v101.1,87.6 102.3,87.6 102.52,87.82 107.56,87.82 111.84,92.1 114.4,92.1 v115.1,92.8
  Bottom 0.61: v119.8,94.55 119.8,94.5 123.2,91.1 123.2,81.4 125.5,79.1 128.6,79.1 128.65,79.05 | v131.1,81.5 128.65,79.05 | v129.9,75.2 129.9,77.8 128.65,79.05
5V0_NBU_NSENS_BST
  Top 0.254: U20.7 129.25,85.65 130.1,86.5 132.52,86.5 C62.2
5V0_NBU_NSENS_FB
  Top 0.254: U20.24 129.25,80.75 129.9,80.1 R78.1
  Top 0.813: R79.2 R78.1 C63.2
5V0_NBU_NSENS_INTVCC  (via drill 0.3)
  Top 0.2: U20.20 127.25,80.75 126.9,80.4 v126.4,80.4
  Top 0.254: U20.2 v131.1,82.55 131.35,82.55 131.6,82.8 C56.1
  Bottom 0.2: v126.4,80.4 128.95,80.4 v131.1,82.55
5V0_NBU_NSENS_PGOOD  (via drill 0.3)
  Top 0.2: U2.45 67.98,50.3 69.98,52.3 R72.1 70.68,52.98 71.6,53.9 72.8,53.9 v76.4,57.5 | v117.9,88.9 111.3,82.3 v111.3,77.2 | U20.23 128.75,80.38 v128.2,79.83 | v125.4,80.6 v123,78.2
  Bottom 0.2: v123,78.2 121.3,79.9 121.3,88 120.4,88.9 v117.9,88.9 | v111.3,77.2 101.3,67.2 86.1,67.2 v76.4,57.5 | v128.2,79.83 126.17,79.83 v125.4,80.6
5V0_NBU_NSENS_RT
  Top 0.254: U20.18 124.95,82.05 122.78,79.88 R71.2
5V0_NBU_NSENS_SS
  Top 0.254: U20.21 127.75,80.65 126.3,79.2 C58.1
5V0_NBU_NSENS_SW
  Top 0.813: C62.1 128.87,89.42 L4.1
  pour Top (no thermals): 126.7,84.9 126.7,87 125.8,87.9 125.8,90.5 131.4,90.5 131.4,87.7 130.7,87 129.9,87 128.8,85.9 128.8,84.9
5V0_VSENSE  (via drill 0.3)
  Top 0.305: U2.48 66.42,51.8 71.2,56.58 v71.2,57.5 C61.1 | R75.2 107.92,77.22 v107.9,77.2
  Top 0.813: R75.2 R74.1
  Bottom 0.305: v107.9,77.2 107.9,75.91 100.72,68.73 85.42,68.73 75.69,59 72.7,59 v71.2,57.5
!5V0_BACKUP  (via drill 0.3)
  Top 0.2: U2.54 v61.3,56.3 | v58.6,62.1 R87.1 | U24.20 96.9,93 96.6,93.3 v96.6,94 | v86.7,85.6 86.7,82.8 v88.6,80.9 | v93.2,80.9 v98,80.9 | v76.8,65.9 75.85,64.95 71.65,64.95 v70.7,65.9 | U22.2 57.8,72.6 v59.8,74.6
  Bottom 0.2: v61.3,56.3 62.2,57.2 62.2,58.5 v58.6,62.1 61.45,64.95 | v96.6,94 88.2,85.6 v86.7,85.6 | v88.6,80.9 v93.2,80.9 | v98,80.9 101.05,80.9 103.15,78.8 103.15,74.57 99.83,71.25 84.63,71.25 78.33,64.95 77.75,64.95 v76.8,65.9 | v70.7,65.9 69.75,64.95 61.45,64.95 | v59.8,74.6 60.5,73.9 60.5,65.91 61.45,64.95
!ALS_IRQ  (via drill 0.3)
  Top 0.2: U2.7 53.8,37.4 v53.4,37 | v53.4,27.6 56,25 v56,16.5 | v76.8,10 R37.1
  Bottom 0.2: v53.4,37 v53.4,27.6 | v56,16.5 65.1,7.4 75.06,7.4 76.8,9.14 v76.8,10 76.8,11.2 76.5,11.5 U15.7
!BAT_CHRG  (via drill 0.3)
  Top 0.2: U2.52 62.3,53.6 v61.6,52.9 | v62.2,62.1 R89.1 | U24.8 103.1,91 103.8,90.3 v103.8,86.8 | v70.7,64.3 v76.8,64.3
  Bottom 0.2: v61.6,52.9 62.85,54.15 62.85,58.77 62.2,59.42 v62.2,62.1 64.4,64.3 v70.7,64.3 | v103.8,86.8 103.8,74.3 100.1,70.6 84.9,70.6 78.6,64.3 v76.8,64.3
!BAT_CHRG_EN  (via drill 0.3)
  Top 0.2: v60.4,62.1 R91.1 | U2.53 61.8,55.7 v62.1,56 | U24.4 v99.9,87.8 | v76.8,65.1 76.33,64.63 71.17,64.63 v70.7,65.1
  Bottom 0.2: v62.1,56 62.1,56.1 62.53,56.53 62.53,58.63 60.4,60.76 v60.4,62.1 62.93,64.63 70.23,64.63 v70.7,65.1 | v99.9,87.8 99.9,86.9 103.47,83.33 103.47,74.44 99.97,70.93 84.77,70.93 78.47,64.63 77.27,64.63 v76.8,65.1
!BAT_FAULT  (via drill 0.3)
  Top 0.2: U2.51 62.8,53.2 v62.5,52.9 | v64,62.1 R88.1 | U24.9 103.06,91.5 104.13,90.44 104.13,87.27 v104.6,86.8 | v76.8,63.5 76.33,63.97 71.17,63.97 v70.7,63.5
  Bottom 0.2: v62.5,52.9 63.18,53.58 63.18,58.68 64,59.5 v64,62.1 65.87,63.97 70.23,63.97 v70.7,63.5 | v104.6,86.8 104.13,86.33 104.13,74.17 100.23,70.27 85.03,70.27 78.73,63.97 77.27,63.97 v76.8,63.5
!FUEL_GAUGE_IRQ  (via drill 0.3)
  Top 0.2: U2.94 50.8,43.8 53.8,46.8 v53.8,48.5 | v55.1,49.8 56.6,51.3 v58.8,51.3 | v65.8,62.1 R86.1 | U23.5 69.4,85.8 71.7,83.5 v71.7,82.3 | v63.6,82 63.6,77.2 62.4,76 v60.6,76
  Bottom 0.2: v53.8,48.5 v55.1,49.8 | v58.8,51.3 62,51.3 63.51,52.81 63.51,58.55 65.8,60.84 v65.8,62.1 71.4,62.1 73.4,64.1 73.4,66.1 72.7,66.8 64,66.8 61.2,69.6 61.2,75.4 v60.6,76 | v71.7,82.3 71.3,81.9 63.7,81.9 v63.6,82
!GSM_DCD
  Top 0.305: U10.5 131.75,28.35 TP14.TP
!GSM_DTR  (via drill 0.3)
  Top 0.2: U2.20 60.3,37.9 v60.8,37.4 | U10.6 130.65,21.95 129.5,20.8 v123.2,20.8
  Bottom 0.2: v60.8,37.4 64.28,37.4 69.63,32.05 114.34,32.05 123.2,23.19 v123.2,20.8
!GSM_PWRKEY  (via drill 0.3)
  Top 0.305: U10.39 140.8,16.6 v141.2,16.2 | v142.5,26 T1.3
  Bottom 0.305: v141.2,16.2 141.2,24.7 v142.5,26
!GSM_RING
  Top 0.305: U10.7 129.55,28.35 TP13.TP
!IAQ_IRQ  (via drill 0.3)
  Top 0.2: U14.3 3.5,52.1 v3.7,51.9 | v9.7,52 R36.1 | U2.97 50.6,42.3 v51.3,41.6
  Bottom 0.2: v3.7,51.9 3.8,52 v9.7,52 14.21,52 27.19,39.02 40.61,39.02 44.03,42.45 50.45,42.45 v51.3,41.6
!IAQ_RESET  (via drill 0.3)
  Top 0.2: U14.2 2.9,52.2 v2.6,51.9 | v9.7,50.2 R34.1 | U2.98 50.3,41.8 v50.5,41.6
  Bottom 0.2: v2.6,51.9 4.3,50.2 v9.7,50.2 15.55,50.2 27.06,38.69 40.74,38.69 44.17,42.12 49.98,42.12 v50.5,41.6
!IAQ_WAKE  (via drill 0.3)
  Top 0.2: U14.7 v4.1,57.6 | v9.7,53.8 R35.1 | U2.96 50.9,42.8 v51.3,42.4
  Bottom 0.2: v4.1,57.6 7.9,53.8 v9.7,53.8 12.88,53.8 27.33,39.35 40.47,39.35 43.9,42.77 50.93,42.77 v51.3,42.4
!RESET  (via drill 0.3)
  Top 0.2: U2.36 63.3,45.8 62.8,45.3 v59.6,45.3 | v28.1,42.2 R6.1 | TC1.10 23.07,50.97 22.7,50.6 22.7,47.9 v22.1,47.3 20.7,45.9 S1.2 S1.1
  Bottom 0.2: v22.1,47.3 23,47.3 v28.1,42.2 29.6,40.7 39.9,40.7 43.4,44.2 51.6,44.2 52.4,45 54,45 54.9,44.1 58.4,44.1 v59.6,45.3
!TFT_RESET  (via drill 0.3)
  Top 0.2: U2.35 65.7,45.3 66.6,46.2 v66.7,46.2 | v94,64.2 93.7,63.9 93.7,57.7 92.98,56.98 U16.10 | R41.1 88,66.6 v88.4,66.2
  Bottom 0.2: v66.7,46.2 67.65,45.25 69.12,45.25 87.15,63.29 93.08,63.29 93.99,64.2 v94,64.2 92,66.2 v88.4,66.2
!TFT_TOUCH_IRQ  (via drill 0.3)
  Top 0.2: R44.1 87.7,73.8 88.88,74.98 U16.46 94.72,74.98 98.5,71.2 v98.5,64.3 | U2.33 66.4,44.3 v66.7,44.6
  Bottom 0.2: v66.7,44.6 69.39,44.6 87.42,62.63 93.35,62.63 93.79,63.08 95.06,63.08 96.28,64.3 v98.5,64.3
!TFT_TOUCH_RESET  (via drill 0.3)
  Top 0.2: R43.1 88.4,75.6 88.52,75.48 U16.47 94.68,75.48 98.83,71.33 98.83,65.47 v99.4,64.9 | U2.34 66.1,44.8 v66.7,45.4
  Bottom 0.2: v66.7,45.4 67.17,44.93 69.25,44.93 87.29,62.96 93.21,62.96 93.66,63.41 94.92,63.41 96.41,64.9 v99.4,64.9
!UI_BTN1  (via drill 0.3)
  Top 0.2: C37.1 v51.8,24.2 | U2.11 55.8,36.8 v55.7,36.7 | U17.6 60.15,27.65 v60.1,27.6
  Top 0.813: R46.2 R45.1 C37.1
  Bottom 0.2: v51.8,24.2 55.2,27.6 v60.1,27.6 60.1,28.74 55.77,33.06 55.77,35.23 55.5,35.5 55.5,36.5 v55.7,36.7
!UI_BTN2  (via drill 0.3)
  Top 0.2: R48.2 v73.2,24.2 | U2.12 56.3,36.1 v56.1,35.9 | U17.1 65.85,27.65 v65.9,27.6
  Top 0.813: R48.2 R47.1 C38.1
  Bottom 0.2: v73.2,24.2 69.8,27.6 v65.9,27.6 65.4,28.1 61.2,28.1 56.1,33.2 v56.1,35.9
!UI_BTN3  (via drill 0.3)
  Top 0.2: R51.2 v98.2,24.2 | U2.13 v56.8,35.3 | U17.3 65.85,28.95 v65.9,28.9
  Top 0.813: R51.2 R50.1 C41.1
  Bottom 0.2: v98.2,24.2 93.5,28.9 v65.9,28.9 65.43,28.43 61.34,28.43 56.43,33.34 56.43,34.93 v56.8,35.3
!UI_BTN_IRQ  (via drill 0.3)
  Top 0.2: U2.10 55.3,37.6 v55.1,37.4 | v58.7,28.9 58.75,28.95 U17.4
  Bottom 0.2: v55.1,37.4 55.1,35.44 55.45,35.09 55.45,32.93 58.7,29.68 v58.7,28.9
!US0_CS_WIFI  (via drill 0.3)
  Top 0.2: U2.68 54.3,56.8 v54.8,57.3 55,57.5 R15.2 | U4.13 15.45,83.25 v15.2,83.5
  Bottom 0.2: v54.8,57.3 54.1,58 51.89,58 39.81,70.08 19.92,70.08 15.3,74.7 15.3,83.4 v15.2,83.5
!US2_CS_TFT  (via drill 0.3)
  Top 0.2: R42.1 87.9,70.2 88.68,70.98 U16.38 93.71,70.98 96.18,68.51 96.18,64.42 97.3,63.3 v97.3,62.8 | U2.29 v67.3,42.3
  Bottom 0.2: v67.3,42.3 68.01,42.3 87.69,61.98 93.62,61.98 94.06,62.43 95.33,62.43 95.7,62.8 v97.3,62.8
!US3_CS_ISM  (via drill 0.3)
  Top 0.2: U2.4 52.3,37.8 v52.5,37.6 | v35.2,20.2 U5.15 | R19.1 51.12,33.58 v51.1,33.6
  Bottom 0.2: v52.5,37.6 52.5,36.3 51.7,35.5 | v35.2,20.2 35.2,20.81 49.89,35.5 51.7,35.5 | v51.1,33.6 51.1,34.9 51.7,35.5
!USB_PD_IRQ  (via drill 0.3)
  Top 0.2: U2.61 57.8,53.1 v58,52.9 | v56.8,62.1 R57.1 | CON4.2 v51.3,97 | v54.2,80.9 54.2,78.7 v57.1,75.8
  Bottom 0.2: v58,52.9 58,57.35 56.8,58.55 v56.8,62.1 59.8,65.1 59.8,73.1 v57.1,75.8 | v51.3,97 54.2,94.1 v54.2,80.9
!USB_VBUS_HV_EN  (via drill 0.3)
  Top 0.2: CON6.3 v59.3,97.3 | U2.87 50.7,47.3 51.4,48 v51.4,48.5 | v46.9,56.3 46.9,56.84 45.47,58.27 45.47,69.27 v45.5,69.3
  Bottom 0.2: v59.3,97.3 58.07,98.53 47.06,98.53 45.17,96.64 45.17,79.53 42.37,76.73 42.37,72.77 45.5,69.64 v45.5,69.3 | v46.9,56.3 46.9,56.24 51.87,51.27 51.87,48.97 v51.4,48.5
!WIFI_RESET  (via drill 0.3)
  Top 0.2: U2.81 51.7,50.3 v53.2,51.8 | R11.1 v8.6,88.3 6.9,86.6 CON1.1 | U4.32 23.55,85.25 24.2,85.9 v24.2,87.8 | v10.6,94.2 10.6,92.92 R17.2
  Bottom 0.2: v53.2,51.8 50.7,54.3 50.7,56.41 38.99,68.12 19.11,68.12 13.34,73.89 13.34,79.1 12.47,79.97 12.47,86.97 13.3,87.8 | v24.2,87.8 13.3,87.8 | 13.3,87.8 13.3,88.7 12.7,89.3 10.6,89.3 | 10.6,89.3 9.6,89.3 v8.6,88.3 | 10.6,89.3 v10.6,94.2
BAT_CHRG_PROG
  Top 0.254: R90.2 98.5,87.9 98.9,88.3 U24.2
BAT_OC
  Top 0.305: Q4.6 74.35,86.95 74.8,87.4 79.1,87.4 79.55,86.95 U25.3
BAT_OD
  Top 0.305: U25.1 77.65,85.45 77.2,85 72.9,85 72.45,85.45 Q4.4
BAT_PROT_CS
  Top 0.305: U25.2 78.6,85.3 78.9,85 80.6,85 81.82,86.22 R95.2
BAT_PROT_VCC
  Top 0.508: U25.5 78.6,91.58 R94.1
BT_ANT
  Top 0.61: U10.20 117.92,12.2 | 117.92,12.2 R29.1 | R30.2 117.92,12.2
BT_ANT_EXT
  Top 0.61: RFCON3.P$3 R30.1
BT_ANT_INT
  Top 0.508: E2.ANT R29.2
BUZZ_DRV  (via drill 0.3)
  Top 0.508: Q2.3 v20.7,27.2 19.88,28.02 R52.1
  Bottom 0.508: v20.7,27.2 23.2,24.7 B1.2
CCS811_HEATER_PWM
  Top 0.305: U14.4 4.1,52.8 4.3,52.6 4.5,52.6 4.7,52.8 U14.5
DCJACK_DET  (via drill 0.3)
  Top 0.2: U2.92 50.5,44.8 52.2,46.5 v52.2,48.5 | v48.3,97 CON4.5 | v47.8,57.8 47.8,59.8 50.1,62.1 | 50.1,62.1 v50.6,62.1 | R56.1 49.6,62.6 50.1,62.1 | v49.6,70.9 50.55,71.85 50.55,77.75 v50,78.3
  Bottom 0.2: v52.2,48.5 52.2,51.4 47.8,55.8 v47.8,57.8 | v50.6,62.1 50.6,69.9 v49.6,70.9 | v50,78.3 50,90.3 51.4,91.7 51.4,93.9 v48.3,97
EXT_LED_DI  (via drill 0.3)
  Top 0.2: v132.8,67.9 135,67.9 v136.7,69.6 | v143.7,69.6 CON2.2
  Bottom 0.2: D4.2 132.42,67.52 v132.8,67.9 | v143.7,69.6 v136.7,69.6
GBAT  (via drill 0.3 pad 0.85, 0.3 pad 1.1)
  Top 0.508: U25.6 77.65,89.95 v77.2,90.4
  Top 0.61: 72.45,90.15 Q4.3
  Top 0.813: v77.1,93.4 C75.2
  Top 1.016: CON7.2 v72.4,90.8 72.4,90.2 72.45,90.15
  Bottom 0.813: v72.4,90.8 74.5,90.8 | v77.1,93.4 74.5,90.8 | v77.2,90.4 76.8,90.8 74.5,90.8
GND  (via drill 0.3, 0.35)
  Top 0.305: U21.5 72.15,73.95 72.7,73.4 U21.21 73.1,73.4 73.65,73.95 U21.2 | U13.5 2.23,68.62 2.6,69 3.2,69 | 3.2,69 3.52,68.67 U13.7 | U13.1 4.17,66.67 4.8,67.3 | 3.2,69 4.4,69 4.8,68.6 4.8,67.3 | 4.8,67.3 8.3,67.3 | U11.2 3.1,35.6 3.5,36 4.8,36 6.8,34 8.2,34